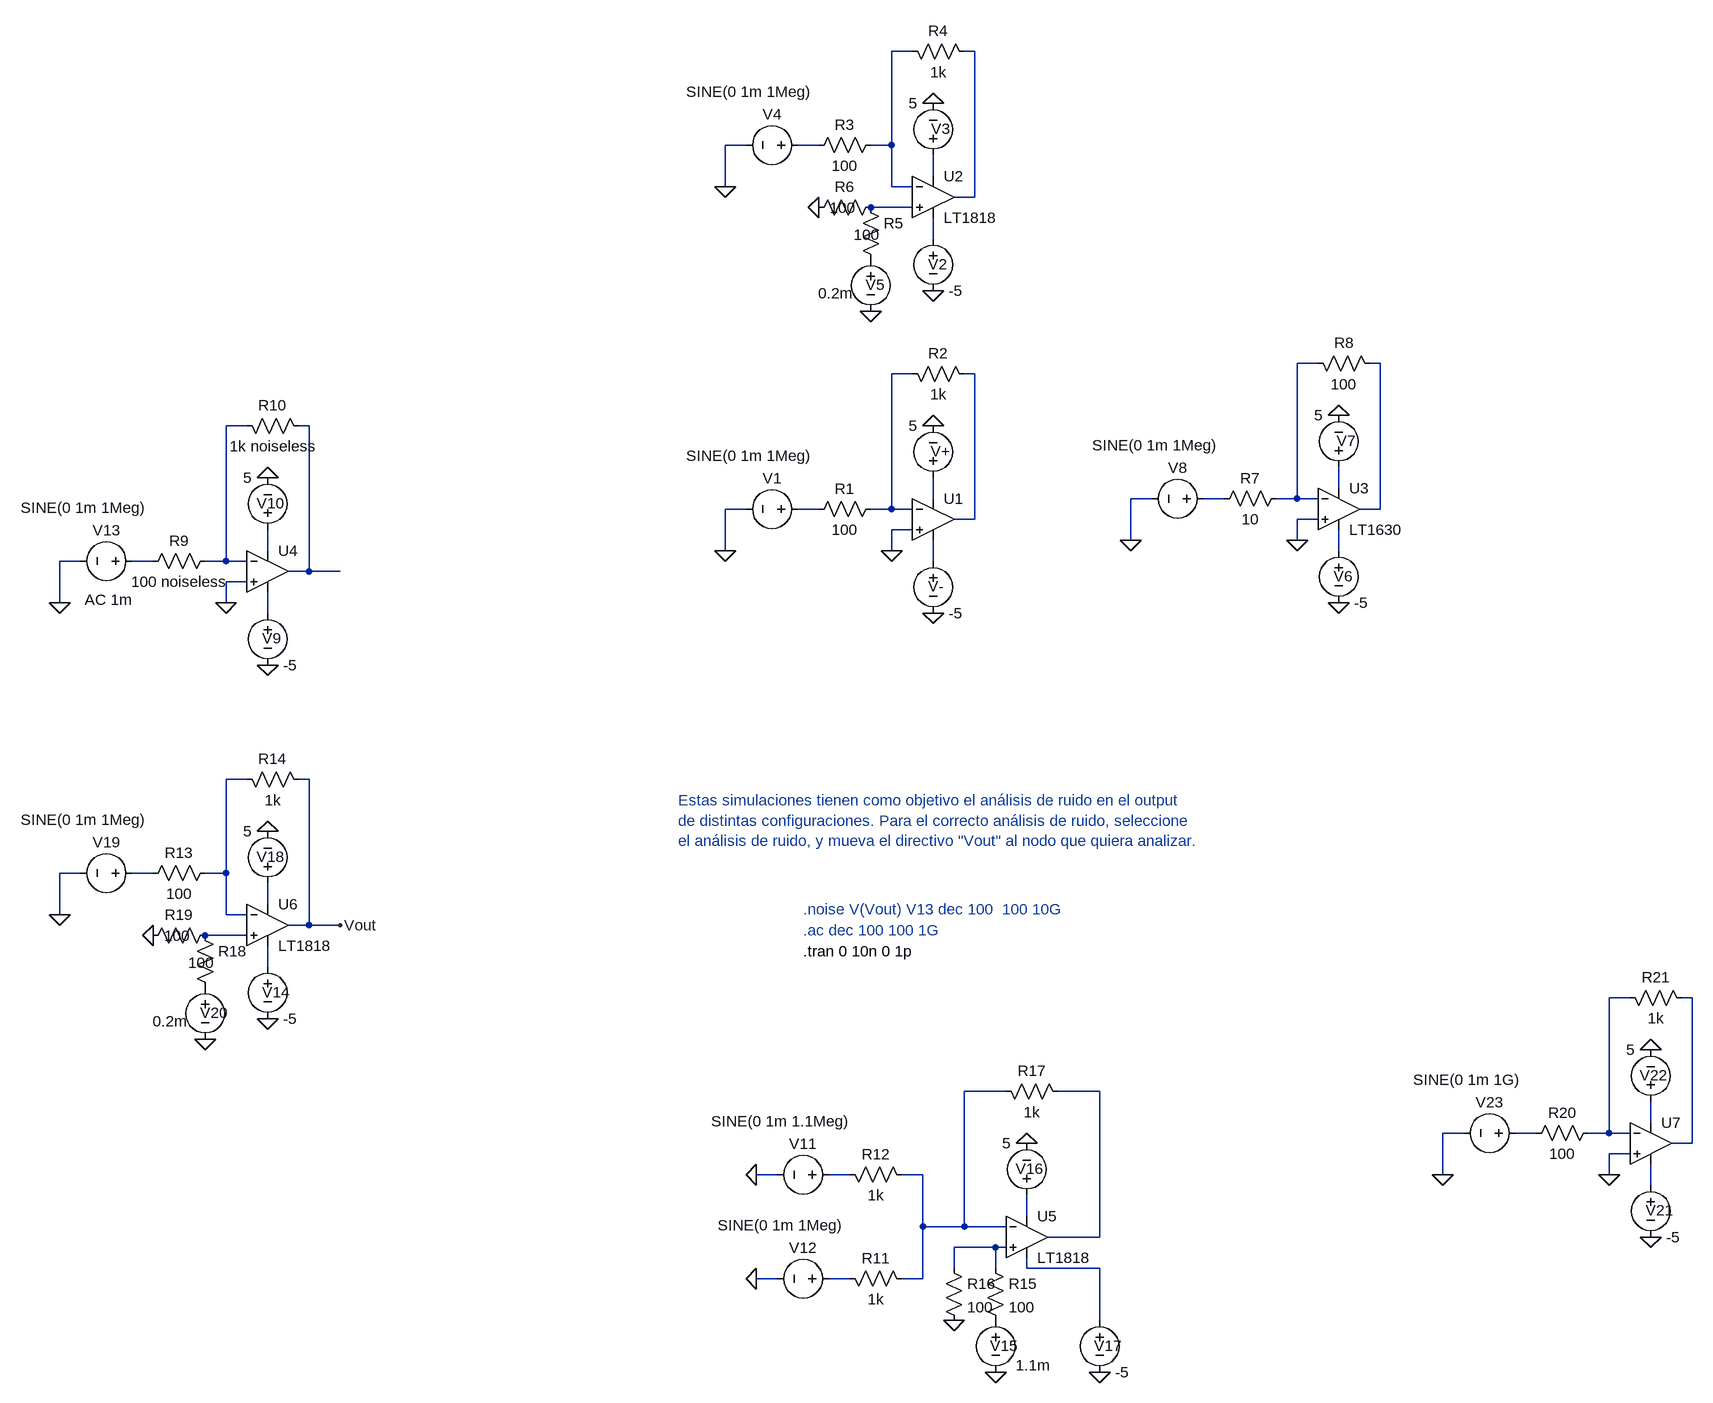
[diagram p0: schematic Sim_Noise.asc]
Sim_Noise.asc, the LTspice schematic file:
Version 4.1
SHEET 1 1012 1796
WIRE -192 -256 -224 -256
WIRE -96 -256 -112 -256
WIRE -448 -112 -480 -112
WIRE -336 -112 -368 -112
WIRE -224 -112 -224 -256
WIRE -224 -112 -256 -112
WIRE -160 -64 -160 -96
WIRE -480 -48 -480 -112
WIRE -224 -48 -224 -112
WIRE -192 -48 -224 -48
WIRE -96 -32 -96 -256
WIRE -96 -32 -128 -32
WIRE -192 -16 -256 -16
WIRE -160 32 -160 0
WIRE 432 224 400 224
WIRE 528 224 512 224
WIRE -192 240 -224 240
WIRE -96 240 -112 240
WIRE -1216 320 -1248 320
WIRE -1120 320 -1136 320
WIRE 464 416 464 384
WIRE -160 432 -160 400
WIRE 176 432 144 432
WIRE 288 432 256 432
WIRE 400 432 400 224
WIRE 400 432 368 432
WIRE 432 432 400 432
WIRE -448 448 -480 448
WIRE -336 448 -368 448
WIRE -224 448 -224 240
WIRE -224 448 -256 448
WIRE -192 448 -224 448
WIRE 528 448 528 224
WIRE 528 448 496 448
WIRE -96 464 -96 240
WIRE -96 464 -128 464
WIRE 432 464 400 464
WIRE -192 480 -224 480
WIRE 144 496 144 432
WIRE 400 496 400 464
WIRE -1184 512 -1184 480
WIRE -480 512 -480 448
WIRE -224 512 -224 480
WIRE 464 512 464 480
WIRE -1472 528 -1504 528
WIRE -1360 528 -1392 528
WIRE -1248 528 -1248 320
WIRE -1248 528 -1280 528
WIRE -1216 528 -1248 528
WIRE -160 528 -160 496
WIRE -1120 544 -1120 320
WIRE -1120 544 -1152 544
WIRE -1072 544 -1120 544
WIRE -1216 560 -1248 560
WIRE -1504 592 -1504 528
WIRE -1248 592 -1248 560
WIRE -1184 608 -1184 576
WIRE -1216 864 -1248 864
WIRE -1120 864 -1136 864
WIRE -1472 1008 -1504 1008
WIRE -1360 1008 -1392 1008
WIRE -1248 1008 -1248 864
WIRE -1248 1008 -1280 1008
WIRE -1184 1056 -1184 1024
WIRE -1504 1072 -1504 1008
WIRE -1248 1072 -1248 1008
WIRE -1216 1072 -1248 1072
WIRE -1120 1088 -1120 864
WIRE -1120 1088 -1152 1088
WIRE -1072 1088 -1120 1088
WIRE -1216 1104 -1280 1104
WIRE -1184 1152 -1184 1120
WIRE 912 1200 880 1200
WIRE 1008 1200 992 1200
WIRE -48 1344 -112 1344
WIRE 96 1344 32 1344
WIRE 944 1392 944 1360
WIRE 656 1408 624 1408
WIRE 768 1408 736 1408
WIRE 880 1408 880 1200
WIRE 880 1408 848 1408
WIRE 912 1408 880 1408
WIRE 1008 1424 1008 1200
WIRE 1008 1424 976 1424
WIRE 912 1440 880 1440
WIRE -400 1472 -432 1472
WIRE -288 1472 -320 1472
WIRE -176 1472 -208 1472
WIRE 624 1472 624 1408
WIRE 880 1472 880 1440
WIRE 944 1488 944 1456
WIRE -16 1536 -16 1504
WIRE -176 1552 -176 1472
WIRE -112 1552 -112 1344
WIRE -112 1552 -176 1552
WIRE -48 1552 -112 1552
WIRE 96 1568 96 1344
WIRE 96 1568 16 1568
WIRE -64 1584 -128 1584
WIRE -48 1584 -64 1584
WIRE -128 1616 -128 1584
WIRE -64 1616 -64 1584
WIRE -16 1616 -16 1600
WIRE 96 1616 -16 1616
WIRE -400 1632 -432 1632
WIRE -288 1632 -320 1632
WIRE -176 1632 -176 1552
WIRE -176 1632 -208 1632
WIRE 96 1696 96 1616
FLAG -160 608 0
FLAG -160 320 0
FLAG -480 512 0
FLAG -224 512 0
FLAG -160 112 0
FLAG -160 -176 0
FLAG -480 -48 0
FLAG -336 -16 0
FLAG -256 144 0
FLAG 464 592 0
FLAG 464 304 0
FLAG 144 496 0
FLAG 400 496 0
FLAG -432 1472 0
FLAG -432 1632 0
FLAG -128 1696 0
FLAG -64 1776 0
FLAG -16 1424 0
FLAG 96 1776 0
FLAG -1184 688 0
FLAG -1184 400 0
FLAG -1504 592 0
FLAG -1248 592 0
FLAG -1072 1088 Vout
FLAG -1184 1232 0
FLAG -1184 944 0
FLAG -1504 1072 0
FLAG -1360 1104 0
FLAG -1280 1264 0
FLAG 944 1568 0
FLAG 944 1280 0
FLAG 624 1472 0
FLAG 880 1472 0
SYMBOL voltage -160 512 R0
WINDOW 123 0 0 Left 0
WINDOW 39 0 0 Left 0
WINDOW 0 -8 55 Left 2
SYMATTR InstName V-
SYMATTR Value -5
SYMBOL voltage -160 416 R180
WINDOW 123 0 0 Left 0
WINDOW 39 0 0 Left 0
WINDOW 0 -26 57 Left 2
SYMATTR InstName V+
SYMATTR Value 5
SYMBOL OpAmps\\UniversalOpAmp2 -160 464 R0
SYMATTR InstName U1
SYMATTR Value2 Avol=1Meg GBW=50Meg Slew=10Meg
SYMBOL voltage -352 448 R90
WINDOW 0 -32 56 VBottom 2
WINDOW 3 -98 91 VTop 2
WINDOW 123 0 0 Left 0
WINDOW 39 0 0 Left 0
SYMATTR InstName V1
SYMATTR Value SINE(0 1m 1Meg)
SYMBOL res -240 432 R90
WINDOW 0 0 56 VBottom 2
WINDOW 3 32 56 VTop 2
SYMATTR InstName R1
SYMATTR Value 100
SYMBOL res -208 224 M90
WINDOW 0 0 56 VBottom 2
WINDOW 3 32 56 VTop 2
SYMATTR InstName R2
SYMATTR Value 1k
SYMBOL OpAmps\\LT1818 -160 -32 R0
SYMATTR InstName U2
SYMBOL voltage -160 16 R0
WINDOW 123 0 0 Left 0
WINDOW 39 0 0 Left 0
WINDOW 0 -8 55 Left 2
SYMATTR InstName V2
SYMATTR Value -5
SYMBOL voltage -160 -80 R180
WINDOW 123 0 0 Left 0
WINDOW 39 0 0 Left 0
WINDOW 0 -26 57 Left 2
SYMATTR InstName V3
SYMATTR Value 5
SYMBOL voltage -352 -112 R90
WINDOW 0 -32 56 VBottom 2
WINDOW 3 -98 91 VTop 2
WINDOW 123 0 0 Left 0
WINDOW 39 0 0 Left 0
SYMATTR InstName V4
SYMATTR Value SINE(0 1m 1Meg)
SYMBOL res -240 -128 R90
WINDOW 0 0 56 VBottom 2
WINDOW 3 32 56 VTop 2
SYMATTR InstName R3
SYMATTR Value 100
SYMBOL res -208 -272 M90
WINDOW 0 0 56 VBottom 2
WINDOW 3 32 56 VTop 2
SYMATTR InstName R4
SYMATTR Value 1k
SYMBOL res -272 -32 R0
WINDOW 3 -10 58 Left 2
SYMATTR Value 100
SYMATTR InstName R5
SYMBOL res -240 -32 R90
WINDOW 0 0 56 VBottom 2
WINDOW 3 1 59 VTop 2
SYMATTR InstName R6
SYMATTR Value 100
SYMBOL voltage -256 48 R0
WINDOW 123 0 0 Left 0
WINDOW 39 0 0 Left 0
WINDOW 0 -8 55 Left 2
WINDOW 3 -81 68 Left 2
SYMATTR InstName V5
SYMATTR Value 0.2m
SYMBOL OpAmps\\LT1630 464 384 R0
SYMATTR InstName U3
SYMBOL voltage 464 496 R0
WINDOW 123 0 0 Left 0
WINDOW 39 0 0 Left 0
WINDOW 0 -8 55 Left 2
SYMATTR InstName V6
SYMATTR Value -5
SYMBOL voltage 464 400 R180
WINDOW 123 0 0 Left 0
WINDOW 39 0 0 Left 0
WINDOW 0 -26 57 Left 2
SYMATTR InstName V7
SYMATTR Value 5
SYMBOL voltage 272 432 R90
WINDOW 0 -32 56 VBottom 2
WINDOW 3 -98 91 VTop 2
WINDOW 123 0 0 Left 0
WINDOW 39 0 0 Left 0
SYMATTR InstName V8
SYMATTR Value SINE(0 1m 1Meg)
SYMBOL res 384 416 R90
WINDOW 0 0 56 VBottom 2
WINDOW 3 32 56 VTop 2
SYMATTR InstName R7
SYMATTR Value 10
SYMBOL res 416 208 M90
WINDOW 0 0 56 VBottom 2
WINDOW 3 32 56 VTop 2
SYMATTR InstName R8
SYMATTR Value 100
SYMBOL voltage -304 1472 R90
WINDOW 0 -32 56 VBottom 2
WINDOW 3 -98 91 VTop 2
WINDOW 123 0 0 Left 0
WINDOW 39 0 0 Left 0
SYMATTR InstName V11
SYMATTR Value SINE(0 1m 1.1Meg)
SYMBOL voltage -304 1632 R90
WINDOW 0 -32 56 VBottom 2
WINDOW 3 -98 91 VTop 2
WINDOW 123 0 0 Left 0
WINDOW 39 0 0 Left 0
SYMATTR InstName V12
SYMATTR Value SINE(0 1m 1Meg)
SYMBOL res -304 1616 M90
WINDOW 0 0 56 VBottom 2
WINDOW 3 32 56 VTop 2
SYMATTR InstName R11
SYMATTR Value 1k
SYMBOL res -304 1456 M90
WINDOW 0 0 56 VBottom 2
WINDOW 3 32 56 VTop 2
SYMATTR InstName R12
SYMATTR Value 1k
SYMBOL OpAmps\\LT1818 -16 1568 R0
SYMATTR InstName U5
SYMBOL res -80 1600 R0
SYMATTR InstName R15
SYMATTR Value 100
SYMBOL res -144 1600 R0
SYMATTR InstName R16
SYMATTR Value 100
SYMBOL voltage -64 1680 R0
WINDOW 123 0 0 Left 0
WINDOW 39 0 0 Left 0
WINDOW 0 -8 55 Left 2
WINDOW 3 31 85 Left 2
SYMATTR InstName V15
SYMATTR Value 1.1m
SYMBOL res -64 1328 M90
WINDOW 0 0 56 VBottom 2
WINDOW 3 32 56 VTop 2
SYMATTR InstName R17
SYMATTR Value 1k
SYMBOL voltage -16 1520 R180
WINDOW 123 0 0 Left 0
WINDOW 39 0 0 Left 0
WINDOW 0 -26 57 Left 2
SYMATTR InstName V16
SYMATTR Value 5
SYMBOL voltage 96 1680 R0
WINDOW 123 0 0 Left 0
WINDOW 39 0 0 Left 0
WINDOW 0 -8 55 Left 2
SYMATTR InstName V17
SYMATTR Value -5
SYMBOL voltage -1184 592 R0
WINDOW 123 0 0 Left 0
WINDOW 39 0 0 Left 0
WINDOW 0 -8 55 Left 2
SYMATTR InstName V9
SYMATTR Value -5
SYMBOL voltage -1184 496 R180
WINDOW 123 0 0 Left 0
WINDOW 39 0 0 Left 0
WINDOW 0 -26 57 Left 2
SYMATTR InstName V10
SYMATTR Value 5
SYMBOL OpAmps\\UniversalOpAmp2 -1184 544 R0
SYMATTR InstName U4
SYMATTR Value2 Avol=1Meg GBW=100Meg Slew=10Meg
SYMBOL voltage -1376 528 R90
WINDOW 0 -32 56 VBottom 2
WINDOW 3 -98 91 VTop 2
WINDOW 123 44 53 VTop 2
WINDOW 39 0 0 Left 0
SYMATTR InstName V13
SYMATTR Value SINE(0 1m 1Meg)
SYMATTR Value2 AC 1m
SYMBOL res -1264 512 R90
WINDOW 0 0 56 VBottom 2
WINDOW 3 32 56 VTop 2
SYMATTR InstName R9
SYMATTR Value 100 noiseless
SYMBOL res -1232 304 M90
WINDOW 0 0 56 VBottom 2
WINDOW 3 32 56 VTop 2
SYMATTR InstName R10
SYMATTR Value 1k noiseless
SYMBOL OpAmps\\LT1818 -1184 1088 R0
SYMATTR InstName U6
SYMBOL voltage -1184 1136 R0
WINDOW 123 0 0 Left 0
WINDOW 39 0 0 Left 0
WINDOW 0 -8 55 Left 2
SYMATTR InstName V14
SYMATTR Value -5
SYMBOL voltage -1184 1040 R180
WINDOW 123 0 0 Left 0
WINDOW 39 0 0 Left 0
WINDOW 0 -26 57 Left 2
SYMATTR InstName V18
SYMATTR Value 5
SYMBOL voltage -1376 1008 R90
WINDOW 0 -32 56 VBottom 2
WINDOW 3 -98 91 VTop 2
WINDOW 123 0 0 Left 0
WINDOW 39 0 0 Left 0
SYMATTR InstName V19
SYMATTR Value SINE(0 1m 1Meg)
SYMBOL res -1264 992 R90
WINDOW 0 0 56 VBottom 2
WINDOW 3 32 56 VTop 2
SYMATTR InstName R13
SYMATTR Value 100
SYMBOL res -1232 848 M90
WINDOW 0 0 56 VBottom 2
WINDOW 3 32 56 VTop 2
SYMATTR InstName R14
SYMATTR Value 1k
SYMBOL res -1296 1088 R0
WINDOW 3 -10 58 Left 2
SYMATTR Value 100
SYMATTR InstName R18
SYMBOL res -1264 1088 R90
WINDOW 0 0 56 VBottom 2
WINDOW 3 1 59 VTop 2
SYMATTR InstName R19
SYMATTR Value 100
SYMBOL voltage -1280 1168 R0
WINDOW 123 0 0 Left 0
WINDOW 39 0 0 Left 0
WINDOW 0 -8 55 Left 2
WINDOW 3 -81 68 Left 2
SYMATTR InstName V20
SYMATTR Value 0.2m
SYMBOL voltage 944 1472 R0
WINDOW 123 0 0 Left 0
WINDOW 39 0 0 Left 0
WINDOW 0 -8 55 Left 2
SYMATTR InstName V21
SYMATTR Value -5
SYMBOL voltage 944 1376 R180
WINDOW 123 0 0 Left 0
WINDOW 39 0 0 Left 0
WINDOW 0 -26 57 Left 2
SYMATTR InstName V22
SYMATTR Value 5
SYMBOL OpAmps\\UniversalOpAmp2 944 1424 R0
SYMATTR InstName U7
SYMATTR Value2 Avol=1Meg GBW=8000Meg Slew=2750Meg
SYMBOL voltage 752 1408 R90
WINDOW 0 -32 56 VBottom 2
WINDOW 3 -98 91 VTop 2
WINDOW 123 0 0 Left 0
WINDOW 39 0 0 Left 0
SYMATTR InstName V23
SYMATTR Value SINE(0 1m 1G)
SYMBOL res 864 1392 R90
WINDOW 0 0 56 VBottom 2
WINDOW 3 32 56 VTop 2
SYMATTR InstName R20
SYMATTR Value 100
SYMBOL res 896 1184 M90
WINDOW 0 0 56 VBottom 2
WINDOW 3 32 56 VTop 2
SYMATTR InstName R21
SYMATTR Value 1k
TEXT -360 1128 Left 2 !.tran 0 10n 0 1p
TEXT -360 1064 Left 2 ;.noise V(Vout) V13 dec 100  100 10G
TEXT -360 1096 Left 2 ;.ac dec 100 100 1G
TEXT -552 896 Left 2 ;Estas simulaciones tienen como objetivo el análisis de ruido en el output\nde distintas configuraciones. Para el correcto análisis de ruido, seleccione\nel análisis de ruido, y mueva el directivo "Vout" al nodo que quiera analizar.

The netlist it stands for:
* Sim_Noise.asc
V- N020 0 -5
V+ N014 0 5
X§U1 0 N009 N014 N020 N010 level2 Avol=1Meg GBW=50Meg Slew=10Meg Ilimit=25m Rail=0 Vos=0 En=0 Enk=0 In=0 Ink=0 Rin=500Meg  ; pins In+ In- V+ V- OUT
V1 N016 0 SINE(0 1m 1Meg)
R1 N009 N016 100
R2 N009 N010 1k
X§U2 N005 N001 N002 N004 N006 LT1818  ; pins In+ In- OUT V+ V-
V2 N006 0 -5
V3 N004 0 5
V4 N003 0 SINE(0 1m 1Meg)
R3 N001 N003 100
R4 N001 N002 1k
R5 N005 P001 100
R6 N005 0 100
V5 P001 0 0.2m
X§U3 0 N007 N013 N018 N008 LT1630  ; pins In+ In- V+ V- OUT
V6 N018 0 -5
V7 N013 0 5
V8 N015 0 SINE(0 1m 1Meg)
R7 N007 N015 10
R8 N007 N008 100
V11 N033 0 SINE(0 1m 1.1Meg)
V12 N038 0 SINE(0 1m 1Meg)
R11 N038 N029 1k
R12 N033 N029 1k
X§U5 N036 N029 N030 N035 N037 LT1818  ; pins In+ In- OUT V+ V-
R15 N036 P002 100
R16 N036 0 100
V15 P002 0 1.1m
R17 N029 N030 1k
V16 N035 0 5
V17 N037 0 -5
V9 N021 0 -5
V10 N017 0 5
X§U4 0 N011 N017 N021 N012 level2 Avol=1Meg GBW=100Meg Slew=10Meg Ilimit=25m Rail=0 Vos=0 En=0 Enk=0 In=0 Ink=0 Rin=500Meg  ; pins In+ In- V+ V- OUT
V13 N019 0 SINE(0 1m 1Meg) AC 1m
R9 N011 N019 100 noiseless
R10 N011 N012 1k noiseless
X§U6 N025 N022 Vout N024 N026 LT1818  ; pins In+ In- OUT V+ V-
V14 N026 0 -5
V18 N024 0 5
V19 N023 0 SINE(0 1m 1Meg)
R13 N022 N023 100
R14 N022 Vout 1k
R18 N025 P003 100
R19 N025 0 100
V20 P003 0 0.2m
V21 N034 0 -5
V22 N031 0 5
X§U7 0 N027 N031 N034 N028 level2 Avol=1Meg GBW=8000Meg Slew=2750Meg Ilimit=25m Rail=0 Vos=0 En=0 Enk=0 In=0 Ink=0 Rin=500Meg  ; pins In+ In- V+ V- OUT
V23 N032 0 SINE(0 1m 1G)
R20 N027 N032 100
R21 N027 N028 1k
.tran 0 10n 0 1p
* .noise V(Vout) V13 dec 100  100 10G
* .ac dec 100 100 1G
* Estas simulaciones tienen como objetivo el análisis de ruido en el output
* de distintas configuraciones. Para el correcto análisis de ruido, seleccione
* el análisis de ruido, y mueva el directivo "Vout" al nodo que quiera analizar.
.lib UniversalOpAmp2.lib
.lib LTC2.lib
.backanno
.end